# EAGLE design Arduino Nano2 (EAGLE 7.4.0)
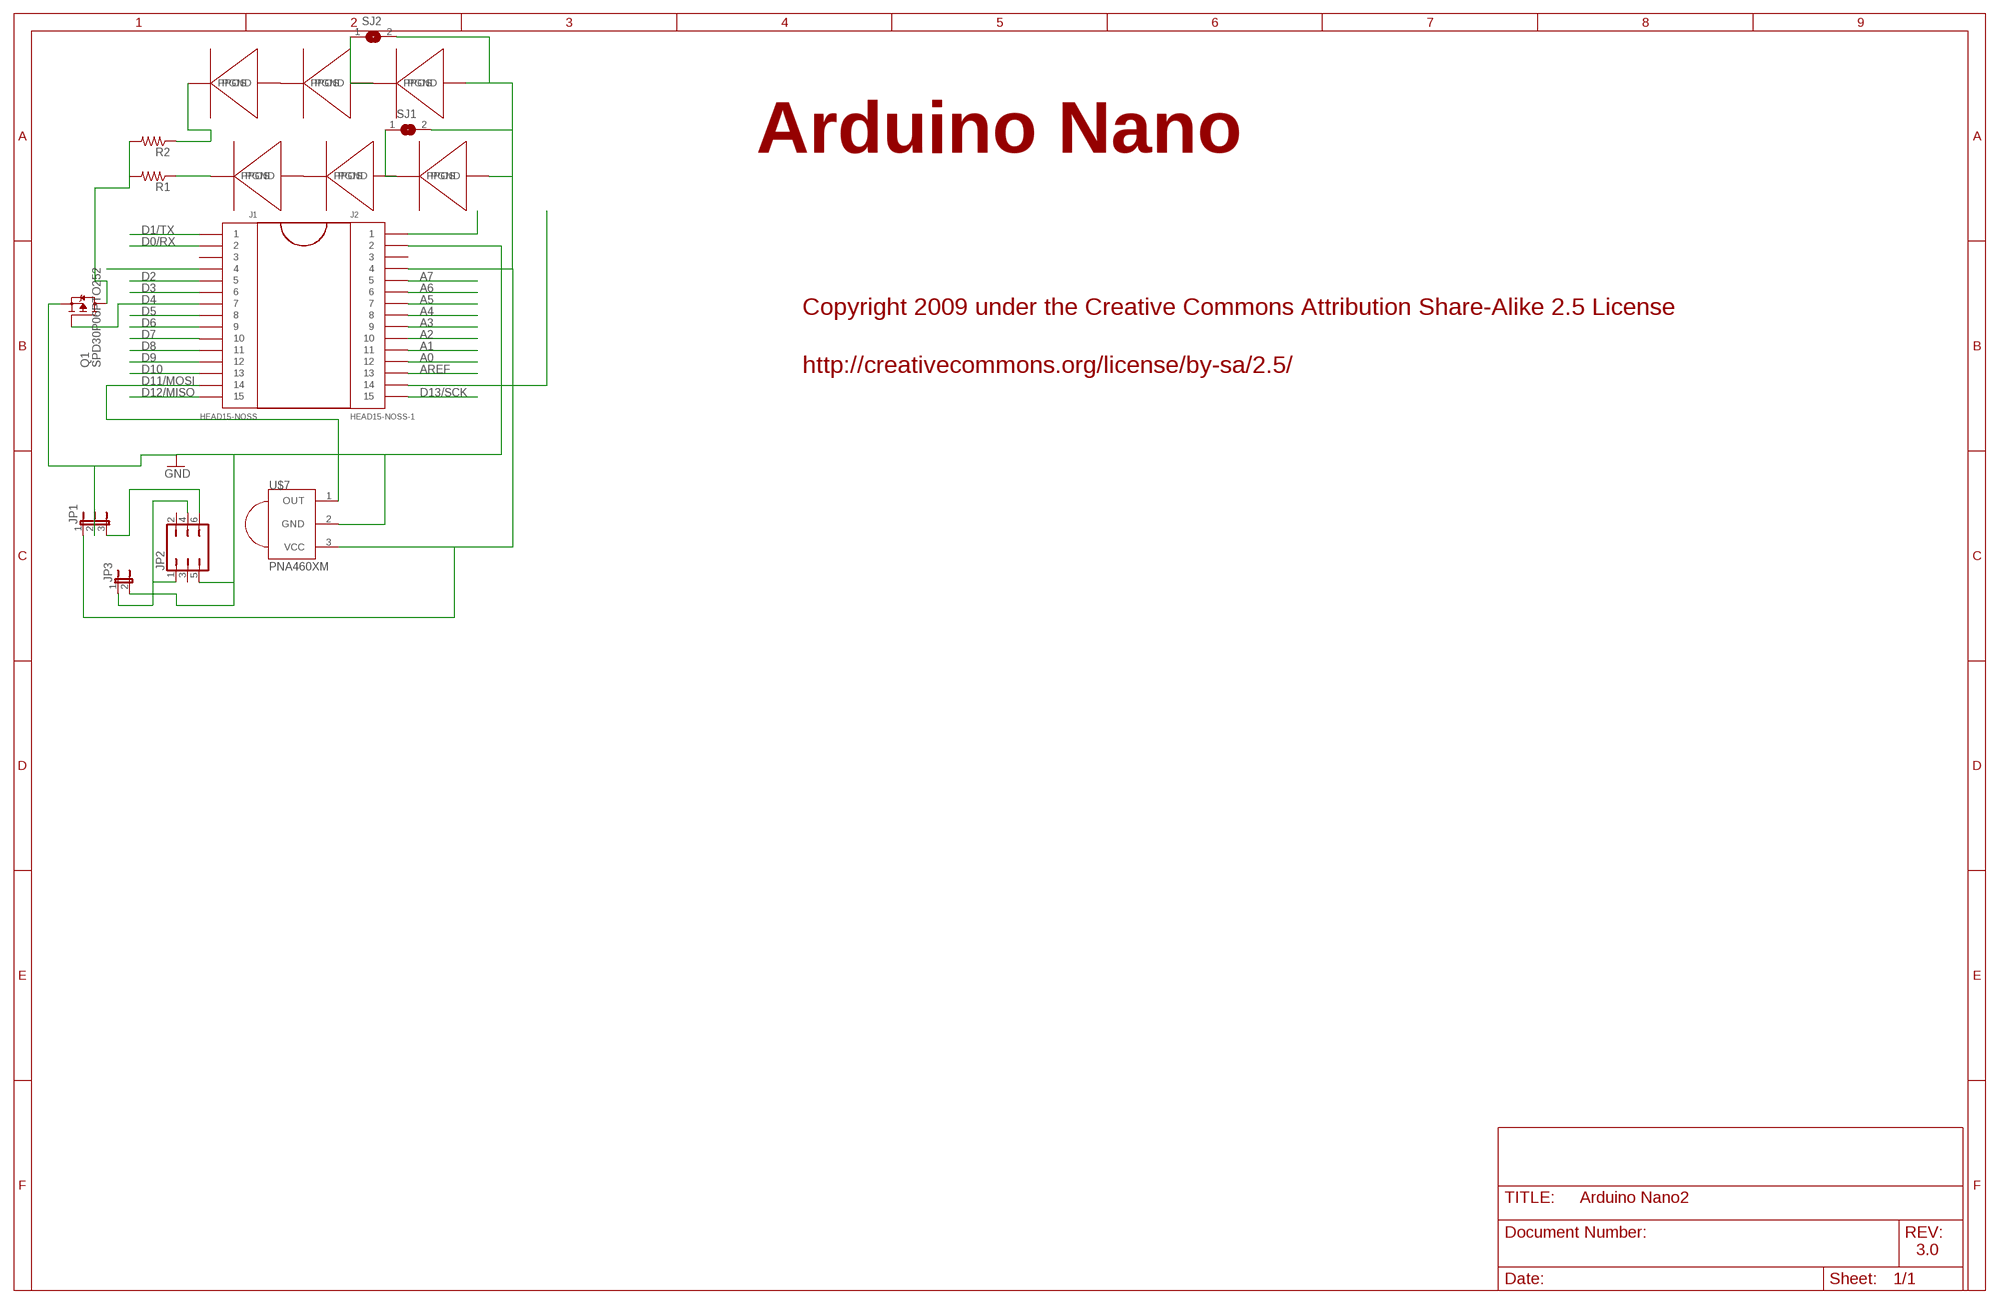
[diagram p0: schematic, sheet 1]

## Parts
J1  HEAD15-NOSS  [HEAD15-NOSS]
J2  HEAD15-NOSS-1  [HEAD15-NOSS-1]
JP1  JP2E  [JP2]
JP2  JP3Q  [JP3Q]
JP3  JP1E  [JP1]
Q1  SPD30P06PTO252  [TO252]
R1  R-US_M1206  [M1206]
R2  R-US_M1206  [M1206]
SJ1  SJ  [SJ]
SJ2  SJ  [SJ]
U$1  SMD-LED-PLCC-2  [PLCC-2]
U$2  SMD-LED-PLCC-2  [PLCC-2]
U$3  SMD-LED-PLCC-2  [PLCC-2]
U$4  SMD-LED-PLCC-2  [PLCC-2]
U$5  SMD-LED-PLCC-2  [PLCC-2]
U$6  SMD-LED-PLCC-2  [PLCC-2]
U$7  PNA460XM  [PNA460XM]

## Nets
A0: J2.12
A1: J2.11
A2: J2.10
A3: J2.9
A4: J2.8
A5: J2.7
A6: J2.6
A7: J2.5
AREF: J2.13
D0/RX: J1.2
D1/TX: J1.1
D2: J1.5
D3: J1.6
D4: J1.7 Q1.1(G)
D5: J1.8
D6: J1.9
D7: J1.10
D8: J1.11
D9: J1.12
D10: J1.13
D11/MOSI: J1.14 U$7.1(OUT)
D12/MISO: J1.15
D13/SCK: J2.15
GND: J2.2 JP1.2 JP2.5 JP3.2 Q1.2(S) U$7.2(GND)
N$1: Q1.3(D) R1.2 R2.2
N$2: J1.4
N$3: J2.1
N$4: J2.4 JP1.1 SJ1.2 SJ2.2 U$3.PPOS U$6.PPOS U$7.3(VCC)
N$5: J2.14
N$6: R2.1 U$1.PGND
N$7: R1.1 U$4.PGND
N$8: U$1.PPOS U$2.PGND
N$9: SJ2.1 U$2.PPOS U$3.PGND
N$10: U$4.PPOS U$5.PGND
N$11: SJ1.1 U$5.PPOS U$6.PGND
N$12: JP1.3 JP2.6
N$13: JP2.1 JP2.4 JP3.1
Unconnected: J1.3 J2.3 JP2.2 JP2.3

## Notes on the sheet
- Arduino Nano
- Copyright 2009 under the Creative Commons Attribution Share-Alike 2.5 License
- http://creativecommons.org/license/by-sa/2.5/
- 3.0

## Library data of the parts
J1 = MyCON2:HEAD15-NOSS
J2 = MyCON2:HEAD15-NOSS-1
JP1 = jumper:JP2E: JUMPER
JP2 = jumper:JP3Q: JUMPER
JP3 = jumper:JP1E: JUMPER
Q1 = transistor-fet:SPD30P06P: SIPMOS(R) Power-Transistor P-Channel, Enhancement mode Source: http://www.infineon.com/upload/Document/cmc_upload/documents/012/3615/SPD_U30P06P.pdf
R1 R2 = rcl:R-US_: RESISTOR, American symbol
SJ1 SJ2 = jumper:SJ: SMD solder JUMPER
U$1-U$6 = macgrid:SMD-LED-PLCC-2
U$7 = adafruit:PNA460XM: IR 38KHz receiver PNA4602 and related receivers http://www.ladyada.net/library/pcb/eaglelibrary.html

## Board
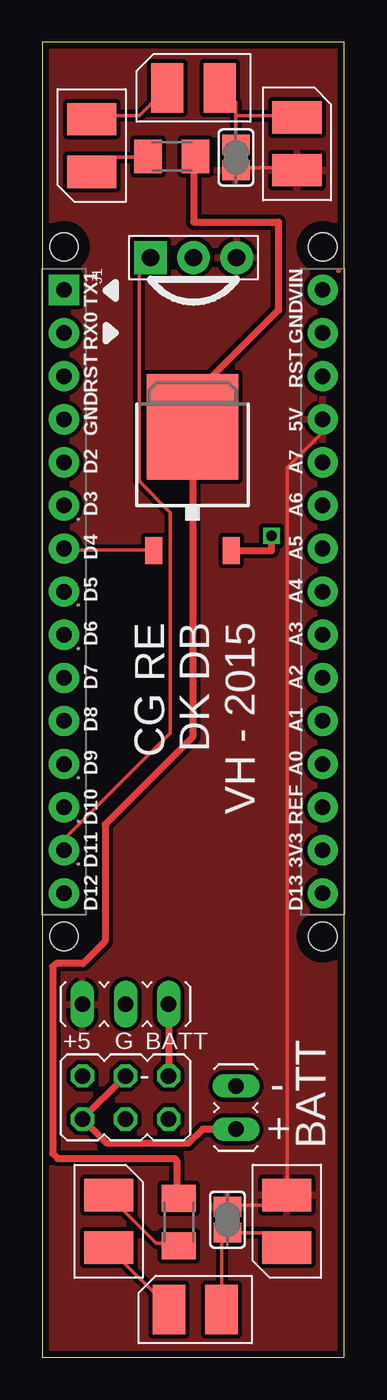
[diagram p1: board, top side]
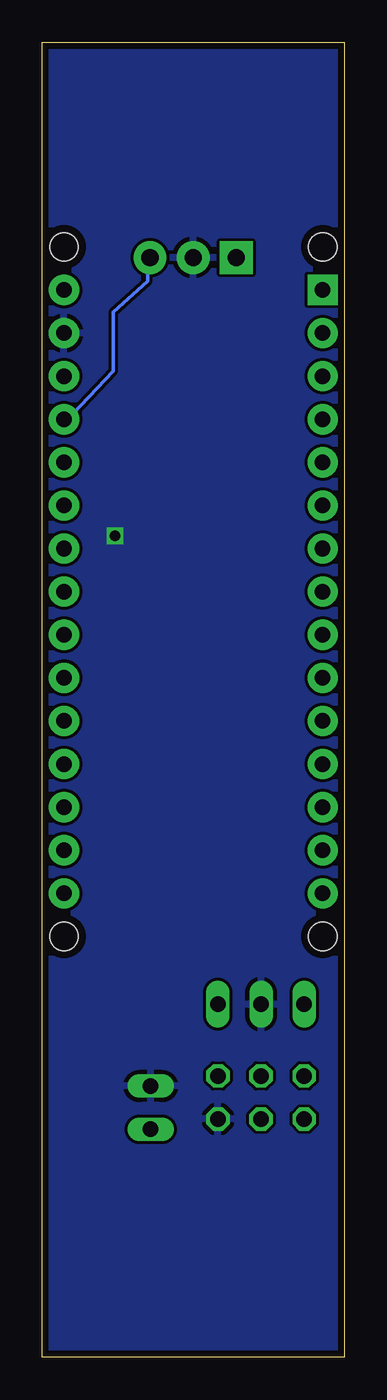
[diagram p2: board, bottom side, seen from below]

Size 17.78 x 77.48 mm. Coordinates in mm from the lower left corner, seen from the top.
Outline: 0,0 17.78,0 17.78,77.48 0,77.48 0,0
Copper layers (1*16): Top 0.0356mm / dielectric 1.5011mm / Bottom 0.0356mm
Design rules "LaenPCBOrder *": minimum track width 6mil, minimum drill 15mil, track to track 7mil, track to pad 7mil, pad to pad 7mil, via to via 7mil, smd to smd 7mil, copper to edge 15mil, drill to drill 6mil, minimum pad ring 7mil, minimum via ring 7mil, stop-mask expansion 3mil, vias tented up to drill 0mil, thermal gap 10mil
Holes 1.65 mm at 1.27,24.79 16.51,24.79 16.51,65.43 1.27,65.43
tRestrict: area 0.1,23.6 to 2.4,25.9; area 15.4,64.3 to 17.7,66.6; area 15.4,23.6 to 17.7,25.9; area 0.1,64.3 to 2.4,66.6
bRestrict: area 15.4,23.6 to 17.7,25.9; area 0.1,23.6 to 2.4,25.9; area 0.1,64.3 to 2.4,66.6; area 15.4,64.3 to 17.7,66.6

### Footprints (pad centres in the part's own frame; a part is rotated, then mirrored left to right if it is on the bottom)
HEAD15-NOSS = drill 0.914 pad 1.778 square: 1 0,0 | drill 0.914 pad 1.778: 2 2.54,0; 3 5.08,0; 4 7.62,0; 5 10.16,0; 6 12.7,0; 7 15.24,0; 8 17.78,0; 9 20.32,0; 10 22.86,0; 11 25.4,0; 12 27.94,0; 13 30.48,0; 14 33.02,0; 15 35.56,0
HEAD15-NOSS-1 = drill 0.914 pad 1.778: 1 0,0; 2 2.54,0; 3 5.08,0; 4 7.62,0; 5 10.16,0; 6 12.7,0; 7 15.24,0; 8 17.78,0; 9 20.32,0; 10 22.86,0; 11 25.4,0; 12 27.94,0; 13 30.48,0; 14 33.02,0; 15 35.56,0
JP2 = drill 0.914 long: 1 -2.54,0; 2 0,0; 3 2.54,0
JP3Q = drill 0.914 octagon: 1 -2.54,-1.27; 2 -2.54,1.27; 3 0,-1.27; 4 0,1.27; 5 2.54,-1.27; 6 2.54,1.27
JP1 = drill 0.914 long: 1 0,-1.27; 2 0,1.27
TO252 = smd 1 x 1.6: 1 -2.28,-4.8; 2 2.28,-4.8 | smd 5.4 x 6.2: 3 0,2.5
M1206 = smd 1.6 x 2: 1 -1.4,0; 2 1.4,0
SJ = smd 1.168 x 1.6: 1 -0.762,0; 2 0.762,0
PLCC-2 = smd 1.9 x 2.9: PGND -1.55,0; PPOS 1.55,0
PNA460XM = drill 1.016 pad 1.93 square: 1 -2.54,0 | drill 1.016 pad 1.93: 2 0,0; 3 2.54,0

### Placement (x,y rotation side)
J1  1.27,62.89 270 top
J2  16.51,62.89 270 top
JP1  4.9,20.8 0 top
JP2  4.9,15.3 0 top
JP3  11.4,14.7 0 top
Q1  8.84,52.33 0 top
R1  8.03,7.96 90 top
R2  7.62,70.76 0 top
SJ1  10.9,8.1 90 top
SJ2  11.4,70.7 270 top
U$1  2.9,71.4 90 top
U$2  8.9,74.8 0 top
U$3  15,71.5 270 top
U$4  3.9,8 270 top
U$5  9,2.8 0 top
U$6  14.4,8 90 top
U$7  8.9,64.8 0 top

### Tracks (layer width: path | path; a pad name or v marks a point on that pad's centre or on a via)
COM
  Top 0.203: 17.48,64.01 17.4,64.01
D4
  Top 0.203: Q1.1 6.5,47.55 1.42,47.55 J1.7
D11/MOSI
  Top 0.203: 5.69,64.01 6.3,64.62 U$7.1 5.69,64.01 | J1.14 1.42,29.87 1.42,30.68 7.52,36.78 7.52,49.78 5.69,51.61 5.69,64.01
GND  (via drill 0.6)
  Top 0.406: Q1.2 13.5,47.53 v13.5,48.4
  Bottom 0.406: v13.5,48.4 13.5,48.5
  pour Bottom: 0.1,0 17.6,0 17.6,77.3 0.1,77.3
N$1
  Top 0.203: 8.94,54.86 Q1.3
  Top 0.406: R2.2 8.9,70.76 8.9,66.9 13.9,66.9 13.9,61.7 9.4,57.2 9.4,55.38 Q1.3 8.84,36.54 3.7,31.4 3.7,24.5 2.4,23.2 0.8,23.2 0.6,23 0.6,12 0.9,11.7 7.8,11.7 7.9,11.6 7.9,9.5 R1.2
N$4
  Top 0.203: SJ1.2 10.97,8.94 13.82,8.94 14.22,9.35 U$6.PPOS 14.43,9.55 14.43,52.43 16.46,54.46 16.46,55.07 J2.4 | SJ2.2 11.58,70.1 14.83,70.1 U$3.PPOS
  Bottom 0.203: U$7.3 11.58,64.62 11.58,63.4 13.61,61.57 13.61,58.12 16.46,55.07 J2.4
  pour Top (isolate 0.254): 0,0 17.6,0 17.6,77.3 7,77.3 0.1,77.4 0,73.3
N$6
  Top 0.203: 3.86,70.71 3.05,69.9 U$1.PGND 3.86,70.71 | 3.86,70.71 6.1,70.71 R2.1
N$7
  Top 0.203: R1.1 7.92,6.71 6.71,6.71 4.06,9.35 U$4.PGND
N$8
  Top 0.203: U$1.PPOS 3.05,73.15 5.69,73.15 7.32,74.78 U$2.PGND
N$9
  Top 0.203: 11.38,73.15 11.38,73.97 10.57,74.78 U$2.PPOS | 11.38,73.15 11.38,71.53 SJ2.1 | 11.38,73.15 14.83,73.15 U$3.PGND
N$10
  Top 0.203: U$4.PPOS 4.06,6.3 7.52,2.85 U$5.PGND
N$11
  Top 0.203: U$6.PGND 14.22,6.5 13.41,7.32 10.97,7.32 SJ1.1 10.77,7.32 10.57,7.11 10.57,2.85 U$5.PPOS
N$12
  Top 0.406: JP1.3 JP2.6
N$13
  Top 0.406: JP3.1 9.43,13.43 8.6,12.6 3.79,12.6 JP2.1 JP2.4

### Text on the board
tPlace: TX1 | VIN | GND | RX0 | RST | RST | 5V | GND | D2 | A7 | D3 | A6 | * | D4 | A5 | D5 | * | A4 | CG RE / DK DB / VH - 2015 | * | D6 | A3 | D7 | A2 | D8 | A1 | * | D9 | A0 | * | D10 | REF | * | D11 | 3V3 | D12 | D13 | BATT | - | - | +